# EAGLE design AirPi1-2 (EAGLE 6.4)
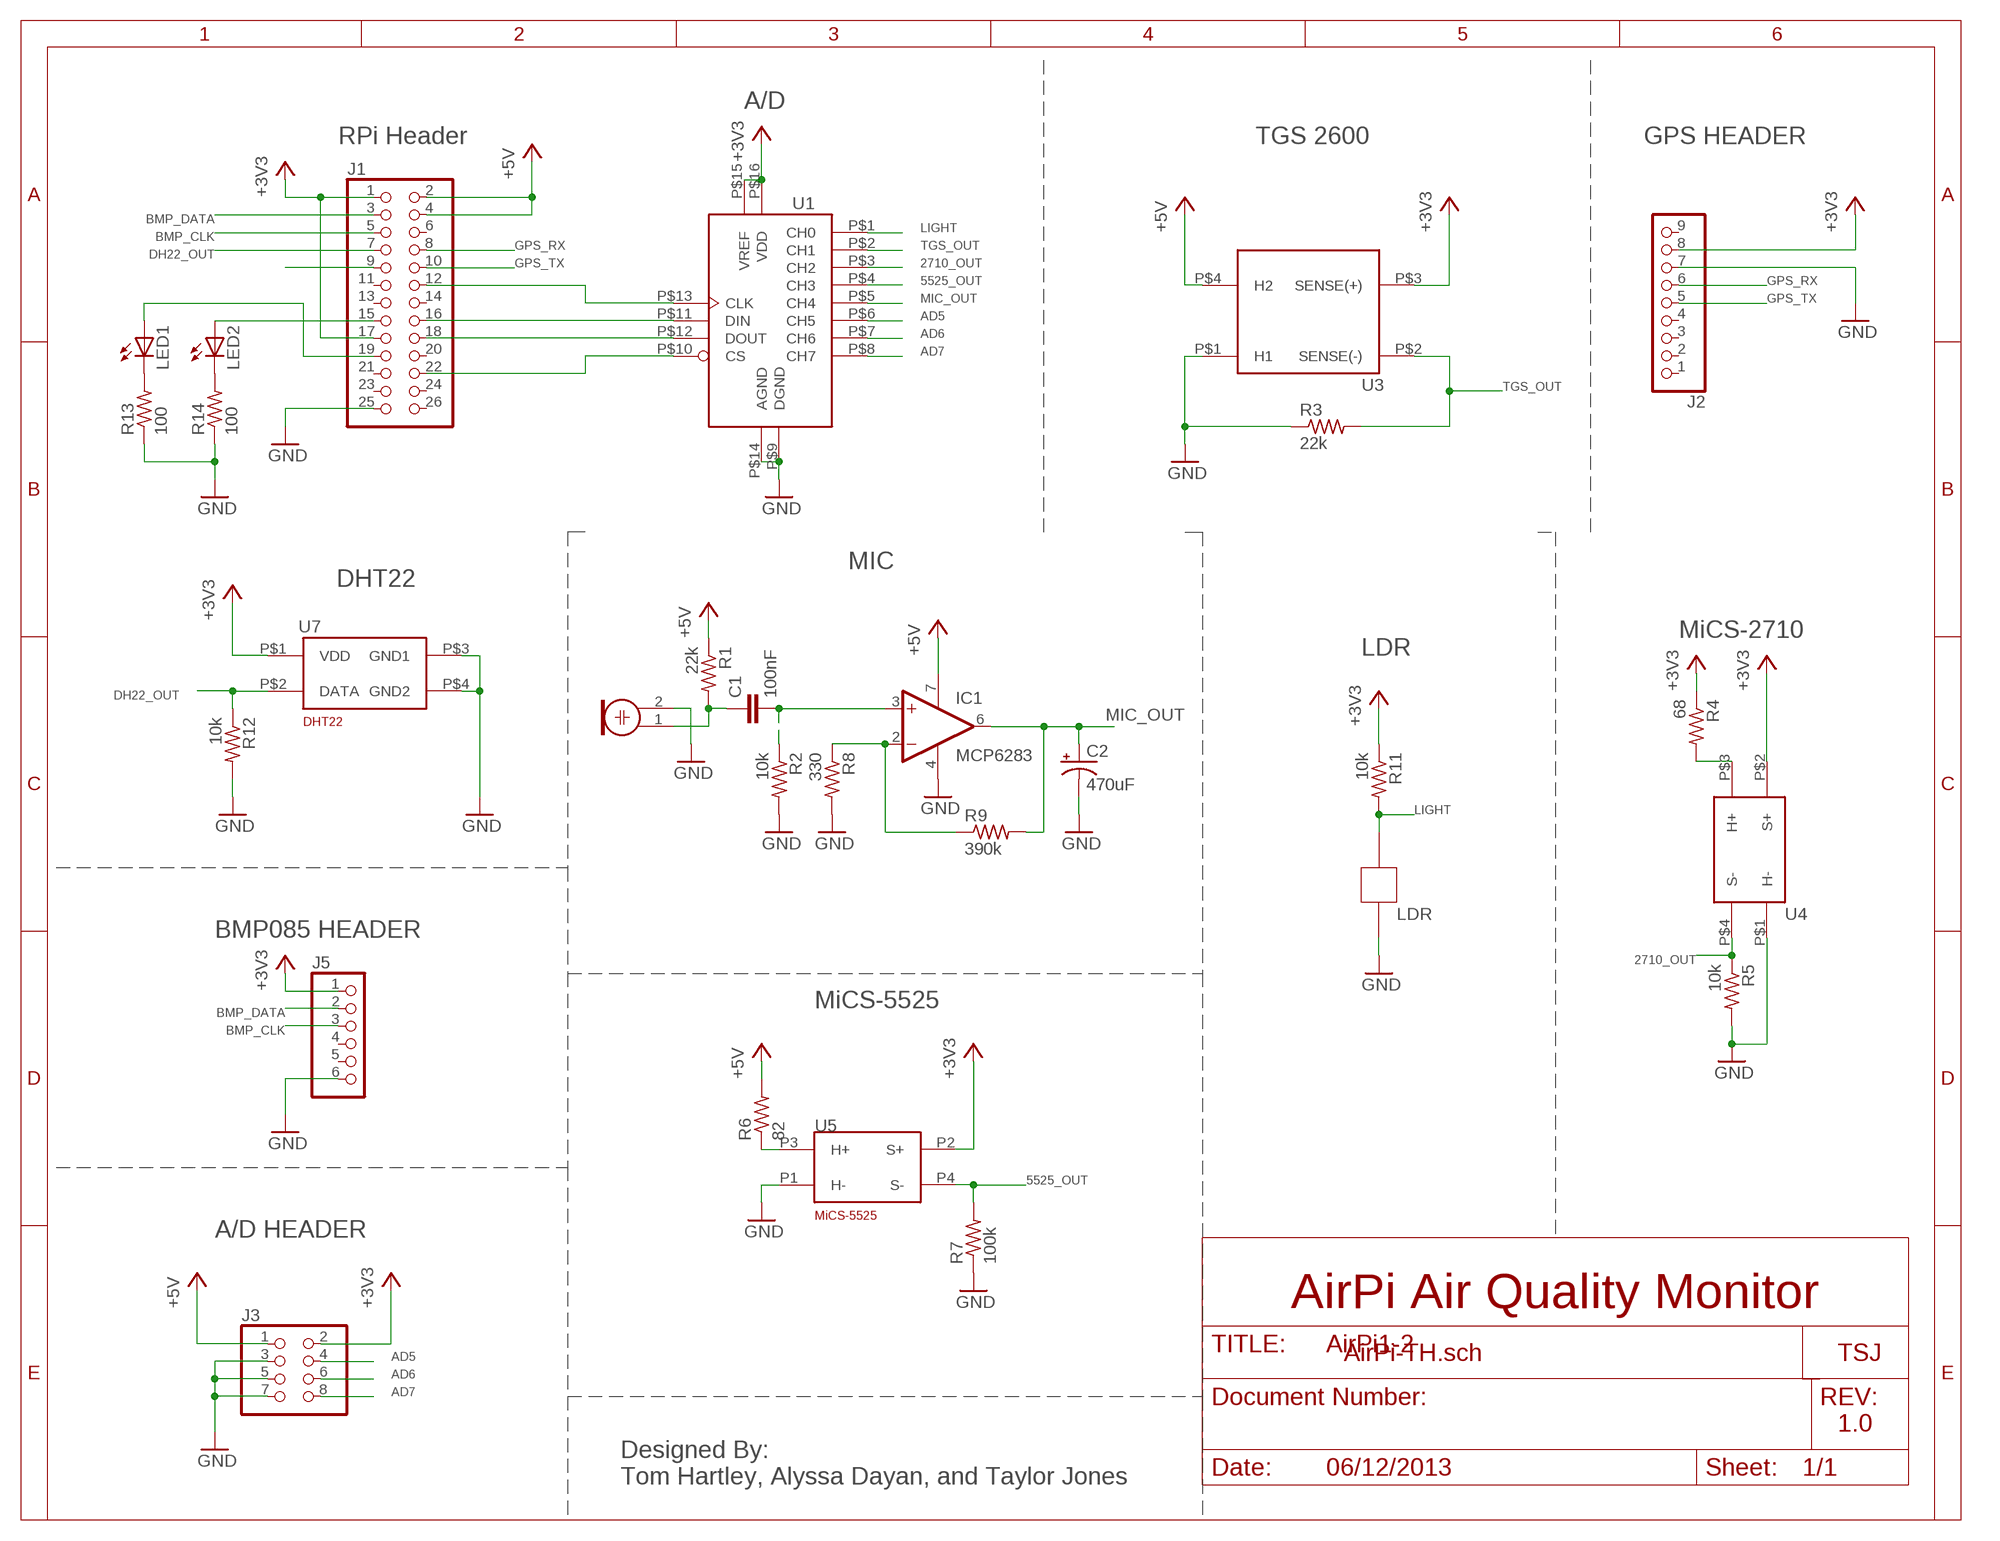
[diagram p0: schematic, sheet 1]

## Parts
C1  100nF  C2.5/4  [C2.5-4]
C2  470uF  CPOL-USE5-10.5  [E5-10,5]
IC1  MCP6283  OPA344P  [DIL08]
J1  PINHD-2X13  [2X13]
J2  PINHD-1X9  [1X09-BIG]
J3  PINHD-2X4  [2X04]
J5  PINHD-1X6  [1X06]
LDR1  LDR  [LED5MM]
LED1  LED3MM  [LED3MM]
LED2  LED3MM  [LED3MM]
M1  MIC  ELECTRET_MICROPHON-WM-62PC/62PK  [WM-62PC/62PK]
R1  22k  R-US_0207/10  [0207/10]
R2  10k  R-US_0207/10  [0207/10]
R3  22k  R-US_0207/10  [0207/10]
R4  68  R-US_0207/10  [0207/10]
R5  10k  R-US_0207/10  [0207/10]
R6  82  R-US_0207/10  [0207/10]
R7  100k  R-US_0207/10  [0207/10]
R8  330  R-US_0207/10  [0207/10]
R9  390k  R-US_0207/10  [0207/10]
R11  10k  R-US_0207/10  [0207/10]
R12  10k  R-US_0207/10  [0207/10]
R13  100  R-US_0207/10  [0207/10]
R14  100  R-US_0207/10  [0207/10]
U1  MCP3008  MCP30081  [DIL16]
U3  TGS2600  [TGS2600]
U4  MICS-2710  [MICS-2710]
U5  MICS-5525  [MICS-5525]
U7  DHT22  [DHT22]

## Nets
2710_OUT: R5.1 U1.P$3(CH2) U4.P$4(S-)
5525_OUT: R7.2 U1.P$4(CH3) U5.P4(S-)
+3V3: J1.1 J1.17 J2.8 J3.2 J5.1 R4.1 R11.1 U1.P$15(VREF) U1.P$16(VDD) U3.P$3(SENSE(+)) U4.P$2(S+) U5.P2(S+) U7.P$1(VDD)
+5V: IC1.7(V+) J1.2 J1.4 J3.1 R1.1 R6.2 U3.P$4(H2)
AD5: J3.4 U1.P$6(CH5)
AD6: J3.6 U1.P$7(CH6)
AD7: J3.8 U1.P$8(CH7)
BMP_CLK: J1.5 J5.3
BMP_DATA: J1.3 J5.2
DH22_OUT: J1.7 R12.1 U7.P$2(DATA)
GND: C2.- IC1.4(V-) J1.25 J2.7 J3.3 J3.5 J3.7 J5.6 LDR1.K M1.2 R2.2 R3.1 R5.2 R7.1 R8.2 R12.2 R13.1 R14.1 U1.P$9(DGND) U1.P$14(AGND) U3.P$1(H1) U4.P$1(H-) U5.P1(H-) U7.P$3(GND1) U7.P$4(GND2)
GPS_RX: J1.8 J2.6
GPS_TX: J1.10 J2.5
LIGHT: LDR1.A R11.2 U1.P$1(CH0)
MIC_OUT: C2.+ IC1.6(OUT) R9.2 U1.P$5(CH4)
N$1: J1.12 U1.P$13(CLK)
N$2: J1.18 U1.P$12(DOUT)
N$3: J1.22 U1.P$10(CS)
N$4: J1.16 U1.P$11(DIN)
N$5: R4.2 U4.P$3(H+)
N$7: C1.1 M1.1 R1.2
N$8: C1.2 IC1.3(+IN) R2.1
N$9: R6.1 U5.P3(H+)
N$10: IC1.2(-IN) R8.1 R9.1
N$13: J1.9
N$18: LED1.K(C) R13.2
N$19: LED2.K(C) R14.2
N$21: J1.19 LED1.A
N$22: J1.15 LED2.A
TGS_OUT: R3.2 U1.P$2(CH1) U3.P$2(SENSE(-))
Unconnected: J1.6 J1.11 J1.13 J1.14 J1.20 J1.21 J1.23 J1.24 J1.26 J2.1 J2.2 J2.3 J2.4 J2.9 J5.4 J5.5

## Notes on the sheet
- A/D
- RPi Header | TGS 2600 | GPS HEADER
- U1
- U3
- MIC
- DHT22
- U7
- MiCS-2710
- LDR
- LDR | U4
- BMP085 HEADER
- MiCS-5525
- U5
- A/D HEADER
- AirPi Air Quality Monitor
- AirPi-TH.sch | TSJ
- 1.0
- 06/12/2013
- Designed By:
  Tom Hartley, Alyssa Dayan, and Taylor Jones

## Library data of the parts
C1 = capacitor-wima:C: CAPACITOR naming: grid - package width
C2 = rcl:CPOL-US: POLARIZED CAPACITOR, American symbol
IC1 = linear:OPA*: Single Operational Amplifier Low Power, Single-Supply, Rail-To-Rail Operational Amplifier Source: http://focus.ti.com/lit/ds/symlink/opa2345.pdf
J1 = pinhead:PINHD-2X13: PIN HEADER
J2 = adafruit:PINHD-1X9: Pin header 1x10 0.1" spacing With round pins
J3 = adafruit:PINHD-2X4: PIN HEADER
J5 = adafruit:PINHD-1X6: PIN HEADER
LDR1 = tjones:LDR
LED1 LED2 = adafruit:LED: LED OSRAM: - CHIPLED LG R971, LG N971, LY N971, LG Q971, LY Q971, LO R971, LY R971 LH N974, LH R974 LS Q976, LO Q976, LY Q976 LO Q996 - Hyper CHIPLED LW Q18S LB Q993, LB Q99A, LB R99A - SideLED LS A670, LO A670, LY A670, LG A670, LP A670 LB A673, LV A673, LT A673, LW A673 LH A674 LY A675 LS A676, LA A676, LO A676, LY A676, LW A676 LS A679, LY A679, LG A679 - Hyper Micro SIDELED® LS Y876, LA Y876, LO Y876, LY Y876 LT Y87S - SmartLED LW L88C, LW L88S LB L89C, LB L89S, LG L890 LS L89K, LO L89K, LY L89K LS L896, LA L896, LO L896, LY L896 - TOPLED LS T670, LO T670, LY T670, LG T670, LP T670 LSG T670, LSP T670, LSY T670, LOP T670, LYG T670 LG T671, LOG T671, LSG T671 LB T673, LV T673, LT T673, LW T673 LH T674 LS T676, LA T676, LO T676, LY T676, LB T676, LH T676, LSB T676, LW T676 LB T67C, LV T67C, LT T67C, LS T67K, LO T67K, LY T67K, LW E67C LS E67B, LA E67B, LO E67B, LY E67B, LB E67C, LV E67C, LT E67C LW T67C LS T679, LY T679, LG T679 LS T770, LO T770, LY T770, LG T770, LP T770 LB T773, LV T773, LT T773, LW T773 LH T774 LS E675, LA E675, LY E675, LS T675 LS T776, LA T776, LO T776, LY T776, LB T776 LHGB T686 LT T68C, LB T68C - Hyper Mini TOPLED® LB M676 - Mini TOPLED Santana® LG M470 LS M47K, LO M47K, LY M47K Source: http://www.osram.convergy.de/
M1 = microphon:ELECTRET_MICROPHON-: Electret Condenser Microphone
R1-R9 R11-R14 = adafruit:R-US_: RESISTOR, American symbol
U1 = tjones:MCP3008
U3 = tjones:TGS2600
U4 = tjones:MICS-2710
U5 = tjones:MICS-5525
U7 = tjones:DHT22

## Board
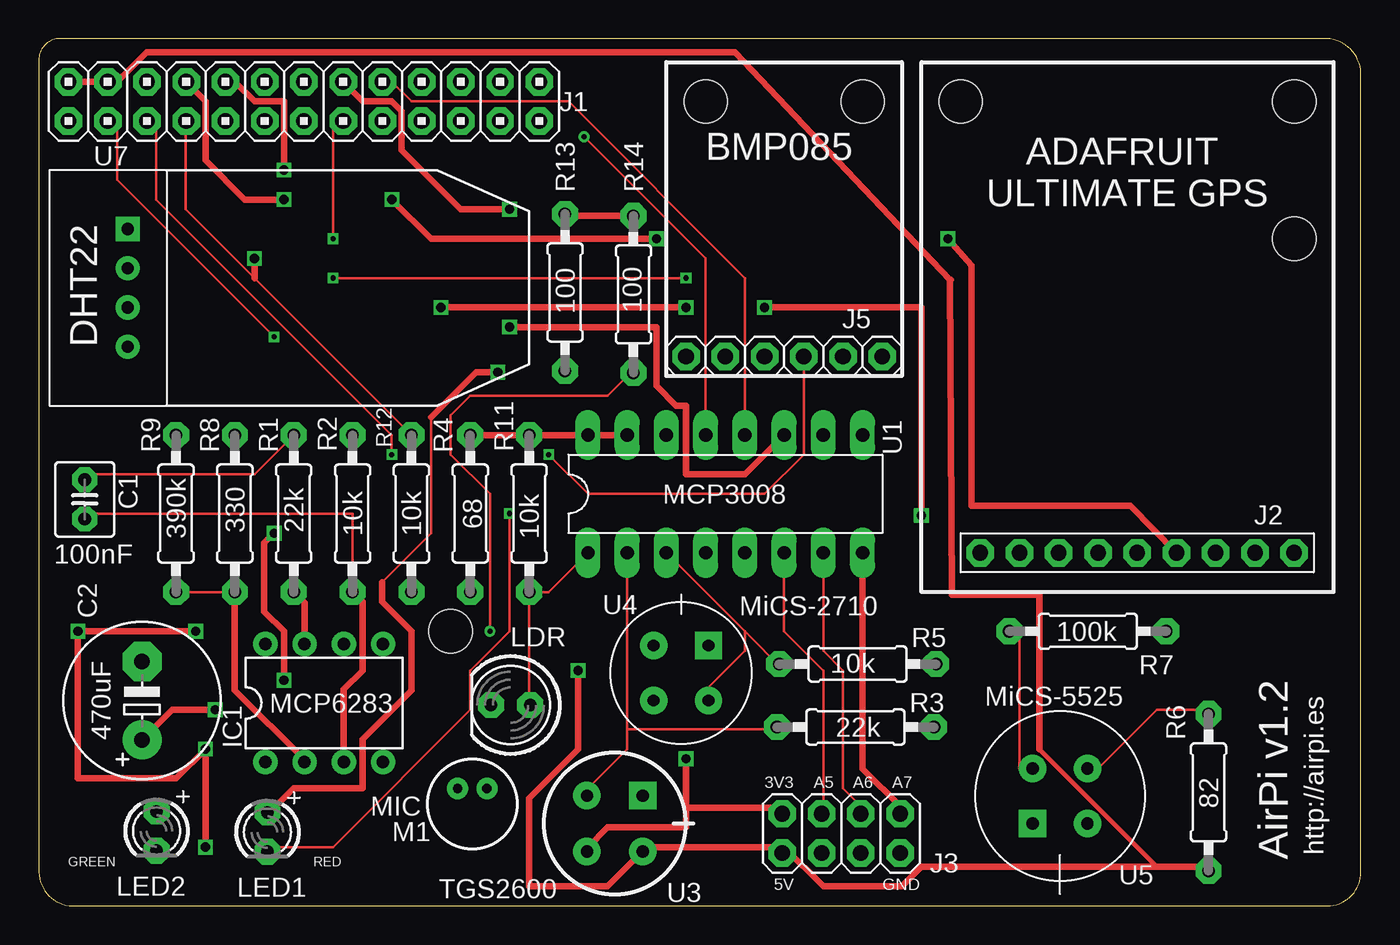
[diagram p1: board, top side]
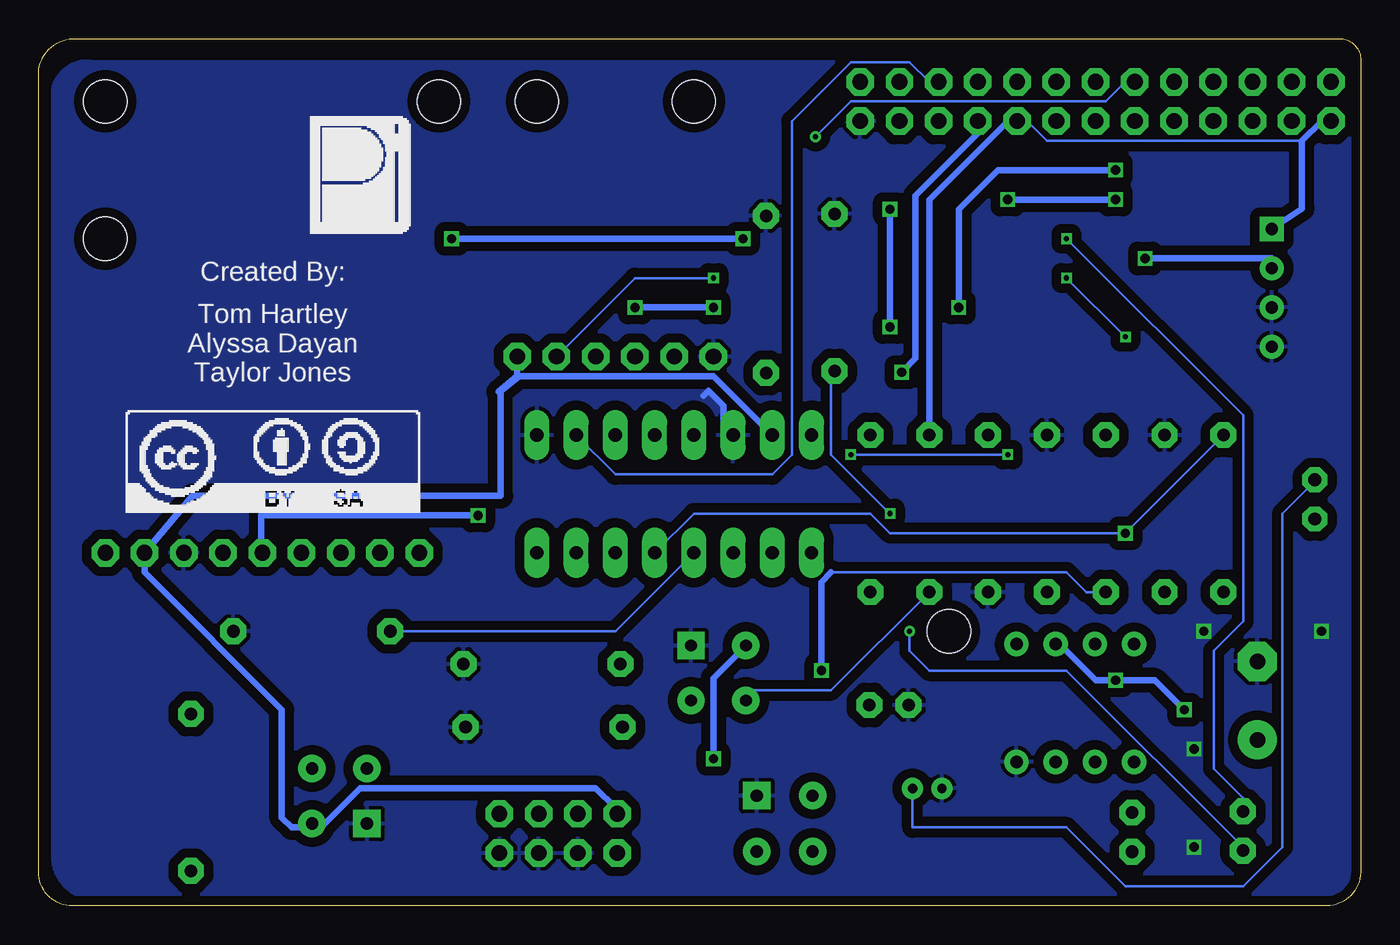
[diagram p2: board, bottom side, seen from below]

Size 85.61 x 56.13 mm. Coordinates in mm from the lower left corner, seen from the top.
Outline: 0.01,54.6 0.01,2.19 arc90 2.39,0 83.42,0 arc90 85.6,2.19 85.6,53.7 arc90 83.42,56.13 1.29,56.13 arc90 0.01,54.6
Copper layers (1*16): Top 0.0356mm / dielectric 1.5011mm / Bottom 0.0356mm
Design rules "LaenPCBOrder *": minimum track width 6mil, minimum drill 13mil, track to track 6mil, track to pad 6mil, pad to pad 6mil, via to via 6mil, smd to smd 6mil, copper to edge 15mil, drill to drill 6mil, minimum pad ring 15mil, minimum via ring 7mil, stop-mask expansion 4mil, vias tented up to drill 0mil, thermal gap 10mil
Holes 2.8 mm at 26.68,17.78 81.29,43.18 53.35,52.07 81.29,52.07 59.7,52.07 43.19,52.07

### Footprints (pad centres in the part's own frame; a part is rotated, then mirrored left to right if it is on the bottom)
C2.5-4 = drill 0.813 pad 1.6 octagon: 1 -1.27,0; 2 1.27,0
E5-10,5 = drill 1.016 pad 2.54: + -2.54,0 | drill 1.016 pad 2.54 octagon: - 2.54,0
DIL08 = drill 0.813 pad 1.27: 1 -3.81,-3.81; 2 -1.27,-3.81; 3 1.27,-3.81; 4 3.81,-3.81; 5 3.81,3.81; 6 1.27,3.81; 7 -1.27,3.81; 8 -3.81,3.81
2X13 = drill 1.016 octagon: 1 -15.24,-1.27; 2 -15.24,1.27; 3 -12.7,-1.27; 4 -12.7,1.27; 5 -10.16,-1.27; 6 -10.16,1.27; 7 -7.62,-1.27; 8 -7.62,1.27; 9 -5.08,-1.27; 10 -5.08,1.27; 11 -2.54,-1.27; 12 -2.54,1.27; 13 0,-1.27; 14 0,1.27; 15 2.54,-1.27; 16 2.54,1.27; 17 5.08,-1.27; 18 5.08,1.27; 19 7.62,-1.27; 20 7.62,1.27; 21 10.16,-1.27; 22 10.16,1.27; 23 12.7,-1.27; 24 12.7,1.27; 25 15.24,-1.27; 26 15.24,1.27
1X09-BIG = drill 1.016 pad 1.778 octagon: 1 -10.16,0; 2 -7.62,0; 3 -5.08,0; 4 -2.54,0; 5 0,0; 6 2.54,0; 7 5.08,0; 8 7.62,0; 9 10.16,0
2X04 = drill 1.016 pad 1.676 octagon: 1 -3.81,-1.27; 2 -3.81,1.27; 3 -1.27,-1.27; 4 -1.27,1.27; 5 1.27,-1.27; 6 1.27,1.27; 7 3.81,-1.27; 8 3.81,1.27
1X06 = drill 1.016 octagon: 1 -6.35,0; 2 -3.81,0; 3 -1.27,0; 4 1.27,0; 5 3.81,0; 6 6.35,0
LED5MM = drill 0.813 pad 1.676 octagon: A -1.27,0; K 1.27,0
LED3MM = drill 0.813 pad 1.676 octagon: A -1.27,0; K 1.27,0
WM-62PC/62PK = drill 0.6 pad 1: 1 -1,0.95; 2 -1,-0.95
0207/10 = drill 0.813 pad 1.676 octagon: 1 -5.08,0; 2 5.08,0
DIL16 = drill 0.864 long: P$1 -8.89,-3.81; P$2 -6.35,-3.81; P$3 -3.81,-3.81; P$4 -1.27,-3.81; P$5 1.27,-3.81; P$6 3.81,-3.81; P$7 6.35,-3.81; P$8 8.89,-3.81; P$9 8.89,3.81; P$10 6.35,3.81; P$11 3.81,3.81; P$12 1.27,3.81; P$13 -1.27,3.81; P$14 -3.81,3.81; P$15 -6.35,3.81; P$16 -8.89,3.81
TGS2600 = drill 0.8 pad 1.778 square: P$1 -1.803,1.803 | drill 0.8 pad 1.778: P$2 -1.803,-1.803; P$3 1.803,-1.803; P$4 1.803,1.803
MICS-2710 = drill 0.762 pad 1.778 square: P$1 1.778,1.778 | drill 0.762 pad 1.778: P$2 -1.778,1.778; P$3 -1.778,-1.778; P$4 1.778,-1.778
MICS-5525 = drill 0.8 pad 1.778 square: P1 1.778,1.778 | drill 0.8 pad 1.778: P2 -1.778,1.778; P3 -1.778,-1.778; P4 1.778,-1.778
DHT22 = drill 0.8 square: P$1 0,0 | drill 0.8: P$2 2.54,0; P$3 5.08,0; P$4 7.62,0

### Placement (x,y rotation side)
C1  2.98,26.31 270 top
C2  6.7,13.29 90 top
IC1  18.49,13.14 0 top
J1  17.18,52.07 0 top
J2  71.13,22.86 0 top
J3  51.96,4.7 0 top
J5  48.27,35.56 180 top
LDR1  30.56,13 180 top
LED1  14.81,4.78 270 top
LED2  7.63,4.85 270 top
M1  28.07,6.6 270 top
R1  16.52,25.4 90 top
R2  20.33,25.4 90 top
R3  52.88,11.58 180 top
R4  27.95,25.4 270 top
R5  53.02,15.66 0 top
R6  75.74,7.35 270 top
R7  67.93,17.78 180 top
R8  12.71,25.4 90 top
R9  8.9,25.4 90 top
R11  31.76,25.4 270 top
R12  24.14,25.4 270 top
R13  34.08,39.71 270 top
R14  38.51,39.58 270 top
U1  44.46,26.67 0 top
U3  37.31,5.33 270 top
U4  41.59,15.07 0 top
U5  66.12,7.11 180 top
U7  5.77,43.81 270 top

### Tracks (layer width: path | path; a pad name or v marks a point on that pad's centre or on a via)
2710_OUT
  Top 0.152: 45.73,17.78 48.27,15.24 R5.1 | 45.73,17.78 U1.P$3 | 45.73,17.78 45.73,16.51 43.19,13.97 U4.P$4
5525_OUT
  Top 0.152: U5.P4 63.51,8.89 63.51,17.78 R7.2
  Bottom 0.152: U1.P$4 48.27,17.78 R7.2
+3V3  (via drill 0.6)
  Top 0.152: 48.27,6.35 J3.2 | 35.57,3.81 U3.P$3
  Top 0.406: U1.P$15 U1.P$16 R11.1 R4.1 | 41.92,6.35 41.92,5.08 36.84,5.08 35.57,3.81 | 41.92,6.35 48.27,6.35 | v41.92,9.53 41.92,6.35
  Bottom 0.152: 2.55,50.8 J1.1 | 22.87,50.8 J1.17 21.6,50.8 20.33,49.53 3.82,49.53 | 67.32,5.08 U5.P2 | 48.27,6.35 J3.2
  Bottom 0.406: 2.55,50.8 3.82,49.53 3.82,45.14 U7.P$1 | R4.1 27.95,45.72 22.87,50.8 | 48.27,6.35 49.54,7.62 64.78,7.62 67.32,5.08 69.22,5.08 69.86,5.71 69.86,12.7 78.75,21.59 J2.8 75.63,26.54 55.7,26.54 55.7,33.21 55.76,33.21 55.76,33.27 54.49,34.29 | U1.P$15 41.92,34.29 54.49,34.29 | 55.82,33.27 54.62,34.29 | 54.62,34.29 54.49,34.29 | U4.P$2 41.92,14.75 v41.92,9.53 | J5.1 54.62,34.29
+5V  (via drill 0.6)
  Top 0.152: 39.38,3.81 U3.P$4 | 74.94,2.54 R6.2 | 48.27,3.81 J3.1 | 5.09,53.34 J1.4
  Top 0.305: 72.4,2.54 64.78,10.16
  Top 0.406: J1.4 J1.2 | 39.38,3.81 48.27,3.81 50.81,1.27 55.89,1.27 57.16,2.54 72.4,2.54 74.94,2.54 | 5.09,53.34 6.99,55.24 45.09,55.24 59,40.51 | 59,40.51 59.12,20.13 64.78,20.13 64.78,10.16 | 59.06,40.51 59,40.51 | R1.1 17.22,19.61 IC1.7 | v34.93,15.24 34.93,10.16 31.76,6.99 31.76,1.27 36.84,1.27 U3.P$4
  Bottom 0.152: R1.1 17.79,20.32 19.06,21.59 34.3,21.59 | 39.38,3.81 U3.P$4
  Bottom 0.406: 34.3,21.59 34.93,20.95 v34.93,15.24
AD5
  Top 0.152: U1.P$6 48.27,17.78 50.81,15.24 50.81,6.35 J3.4
AD6
  Top 0.152: U1.P$7 50.81,16.51 52.08,15.24 52.08,7.62 53.35,6.35 J3.6
AD7
  Top 0.152: 55.89,6.35 J3.8
  Top 0.406: 55.89,6.35 53.35,8.89 U1.P$8
BMP_CLK  (via drill 0.33)
  Top 0.152: v22.87,29.21 22.87,30.48 7.63,45.72 7.63,50.8 J1.5 | v33.03,29.21 35.57,26.67 47,26.67 49.54,29.21 J5.3
  Bottom 0.152: v33.03,29.21 v22.87,29.21
BMP_DATA  (via drill 0.33)
  Top 0.152: v15.25,36.83 5.09,46.99 5.09,50.8 J1.3 | v41.92,40.64 v19.06,40.64
  Bottom 0.152: v19.06,40.64 v15.25,36.83 | v41.92,40.64 47,40.64 J5.2
DH22_OUT  (via drill 0.6)
  Top 0.152: R12.1 13.98,40.64 9.53,45.09 9.53,50.77
  Top 0.406: v13.98,41.91 13.98,40.64 | J1.7 9.53,50.77
  Bottom 0.406: U7.P$2 5.77,41.91 v13.98,41.91
GND  (via drill 0.6)
  Top 0.406: v10.17,17.78 v2.55,17.78 2.55,8.26 8.9,8.26 v10.8,10.16 v10.8,3.81 | R13.1 34.21,44.66 R14.1
  Bottom 0.406: U1.P$14 41.28,30.48 41.28,32.38 42.23,33.34 42.55,33.02
  pour Bottom (isolate 0.61): 0.62,54.62 82.01,54.61 arc-90 84.7,52.85 84.7,3.2 arc-90 81.89,0.46 3.07,0.46 arc-90 0.62,2.17
GPS_RX  (via drill 0.6)
  Top 0.406: J1.8 10.83,52.07 10.8,52.05 10.8,48.26 13.34,45.72 v15.88,45.72 | v22.87,45.72 25.41,43.18 v40.01,43.18 | v58.87,43.18 60.39,41.47 60.39,25.91 70.68,25.91 J2.6
  Bottom 0.406: v15.88,45.72 v22.87,45.72 | v40.01,43.18 v58.87,43.18
GPS_TX  (via drill 0.6)
  Top 0.406: J1.10 12.71,53.34 13.98,52.07 15.88,52.07 v15.88,47.62 | v26.04,38.73 v41.92,38.73 | v47,38.73 57.16,38.73 v57.16,25.27
  Bottom 0.406: v15.88,47.62 23.5,47.62 26.04,45.09 v26.04,38.73 | v41.92,38.73 v47,38.73 | 57.16,25.21 v57.16,25.27 71.19,25.27 71.19,22.86 J2.5
LIGHT
  Top 0.152: U1.P$1 33.03,20.32 R11.2 31.76,12.7 LDR1.A
MIC_OUT  (via drill 0.6)
  Top 0.406: C2.+ 8.65,12.7 v11.44,12.7 | v15.25,24.13 14.61,23.5 14.61,19.05 15.88,17.78 v15.88,14.61
  Bottom 0.152: U1.P$5 43.19,25.4 31.76,25.4 30.49,24.13 v15.25,24.13 R9.2
  Bottom 0.406: v11.44,12.7 13.34,14.61 v15.88,14.61 17.15,14.61 19.49,16.95 IC1.6
N$1  (via drill 0.33)
  Top 0.152: U1.P$13 43.19,41.91 v35.31,49.78
  Bottom 0.152: v35.31,49.78 33.03,52.07 16.52,52.07 15.25,53.34 J1.12
N$2
  Top 0.152: U1.P$12 45.73,40.64 34.3,52.07 24.14,52.07 22.87,53.34 J1.18
N$3
  Bottom 0.152: U1.P$10 48.27,27.94 38.11,27.94 36.84,29.21 36.84,50.8 33.03,54.61 29.22,54.61 27.95,53.34 J1.22
N$4  (via drill 0.6)
  Top 0.406: J1.16 20.96,52.09 20.96,52.07 22.87,52.07 23.5,51.44 23.5,48.9 27.31,45.09 v30.49,45.09 | v30.49,37.47 40.01,37.47 40.01,33.66 41.28,32.38 41.92,32.38 41.92,27.94 45.73,27.94 U1.P$11
  Bottom 0.406: v30.49,45.09 v30.49,37.47
N$5
  Bottom 0.152: R4.2 34.3,13.97 39.38,13.97 U4.P$3
N$7
  Top 0.152: R1.2 13.98,27.94 2.55,27.94 C1.1
  Bottom 0.152: C1.1 2.55,27.94 5.09,25.4 5.09,3.81 7.63,1.27 15.25,1.27 19.06,5.08 29.02,5.08 M1.1
N$8
  Top 0.152: R2.1 20.33,25.4 2.55,25.4 C1.2
  Top 0.406: R2.1 20.96,19.68 20.96,15.24 19.76,14.04 IC1.3
N$9
  Top 0.152: R6.1 74.94,12.7 72.4,12.7 68.59,8.89 U5.P3
N$10
  Top 0.152: R8.1 R9.1
  Top 0.406: R8.1 13.34,20.32 12.71,19.68 12.71,13.97 17.22,9.46 IC1.2
N$18  (via drill 0.33)
  Top 0.152: v30.49,25.4 30.49,17.78 27.95,15.24 27.95,12.7 19.06,3.81 15.25,3.81 LED1.K
  Bottom 0.152: v30.49,25.4 34.3,29.21 34.3,34.29 R13.2
N$19  (via drill 0.33)
  Top 0.152: v29.22,17.78 29.22,26.67 26.68,29.21 26.68,31.75 27.95,33.02 36.84,33.02 38.11,34.29 R14.2
  Bottom 0.152: v29.22,17.78 29.22,16.51 27.95,15.24 19.06,15.24 7.63,3.81 LED2.K
N$21  (via drill 0.6)
  Top 0.152: 25.41,31.75 25.41,31.62 25.41,24.13 22.23,20.95 | 15.25,6.35 LED1.A
  Top 0.406: 15.25,6.35 16.52,7.62 20.96,7.62 20.96,10.79 24.14,13.97 24.14,17.78 22.23,19.68 22.23,20.95 | v29.72,34.54 28.33,34.54 25.41,31.62
  Bottom 0.406: J1.19 24.8,50.01 28.83,45.97 28.83,35.43 v29.72,34.54
N$22  (via drill 0.33)
  Top 0.152: v19.06,43.18 19.06,50.8 J1.15
  Bottom 0.152: v19.06,43.18 7.63,31.75 7.63,18.41 9.53,16.51 9.53,8.89 7.63,6.99 7.63,6.35 LED2.A
TGS_OUT
  Top 0.152: 38.11,11.43 38.11,10.16 35.57,7.62 U3.P$2 | 38.11,11.43 U1.P$2 | 38.11,11.43 47,11.43 R3.2

### Text on the board
tPlace: BMP085 | ADAFRUIT / ULTIMATE GPS | DHT22 | 3V3 | A5 | A6 | A7 | AirPi v1.2 | 5V | GND
tNames: MiCS-2710 | MiCS-5525 | GREEN | RED | http://airpi.es | TGS2600 | /home/t/eagle/AirPi/share-alike-jpeg.bmp
bNames: Created By: | Tom Hartley / Alyssa Dayan / Taylor Jones